# Altium schematic sheet Sheet11.SchDoc
size A3
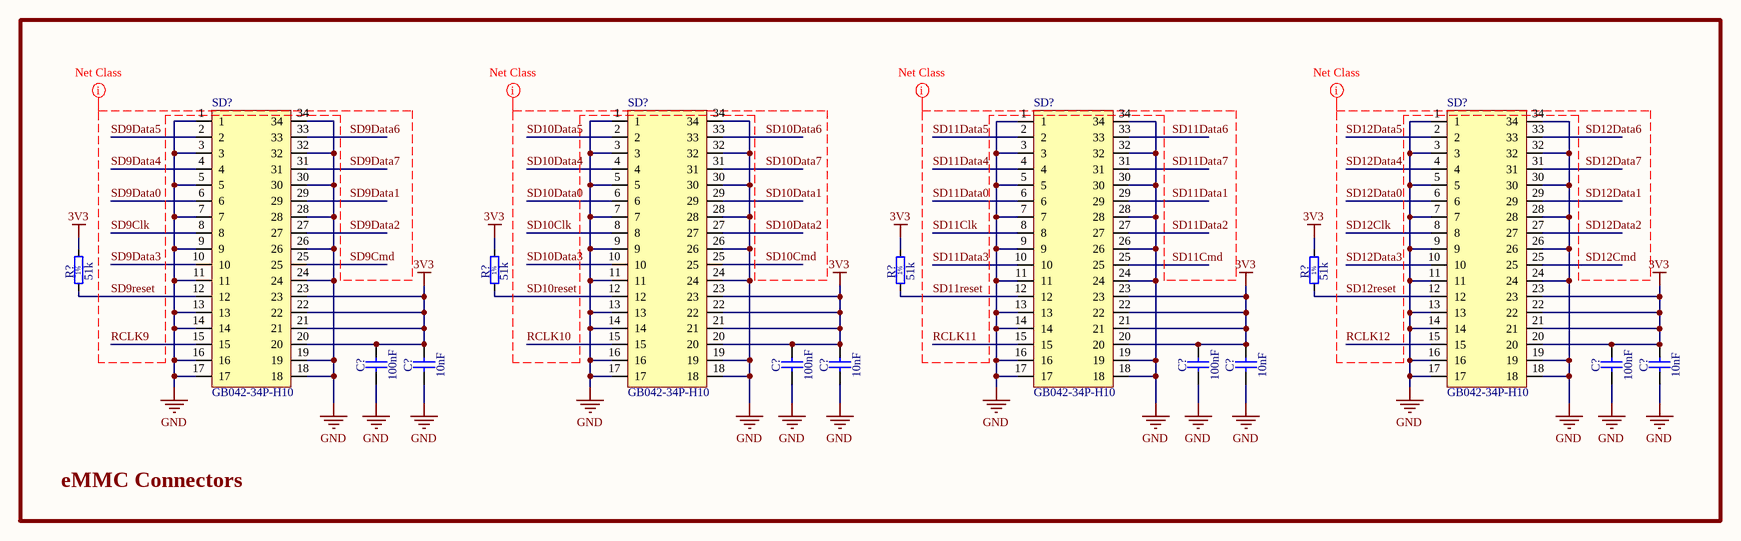
[diagram p0: Sheet11.SchDoc]

## Parts
(Parts that share a designator on the sheet are numbered #1, #2 ... from top to bottom, then left to right.)
C?#1  100nF  [CAPC1608X87N]
C?#2  10nF  [CAPC1608X87N]
C?#3  100nF  [CAPC1608X87N]
C?#4  10nF  [CAPC1608X87N]
C?#5  100nF  [CAPC1608X87N]
C?#6  10nF  [CAPC1608X87N]
C?#7  100nF  [CAPC1608X87N]
C?#8  10nF  [CAPC1608X87N]
R?#1  51k  [RESC1608X55N]
R?#2  51k  [RESC1608X55N]
R?#3  51k  [RESC1608X55N]
R?#4  51k  [RESC1608X55N]
SD?#1  GB042-34P-H10  [GB042-34P-H10]
SD?#2  GB042-34P-H10  [GB042-34P-H10]
SD?#3  GB042-34P-H10  [GB042-34P-H10]
SD?#4  GB042-34P-H10  [GB042-34P-H10]

## Blocks framed on the sheet
eMMC Connectors: C?#1-C?#8 R?#1-R?#4 SD?#1-SD?#4

## Nets
3V3: C?#1.2 C?#2.2 C?#3.2 C?#4.2 C?#5.2 C?#6.2 C?#7.2 C?#8.2 R?#1.2 R?#2.2 R?#3.2 R?#4.2 SD?#1.20 SD?#1.21 SD?#1.22 SD?#1.23 SD?#2.20 SD?#2.21 SD?#2.22 SD?#2.23 SD?#3.20 SD?#3.21 SD?#3.22 SD?#3.23 SD?#4.20 SD?#4.21 SD?#4.22 SD?#4.23
GND: C?#1.1 C?#2.1 C?#3.1 C?#4.1 C?#5.1 C?#6.1 C?#7.1 C?#8.1 SD?#1.1 SD?#1.3 SD?#1.5 SD?#1.7 SD?#1.9 SD?#1.11 SD?#1.13 SD?#1.14 SD?#1.16 SD?#1.17 SD?#1.18 SD?#1.19 SD?#1.24 SD?#1.26 SD?#1.28 SD?#1.30 SD?#1.32 SD?#1.34 SD?#2.1 SD?#2.3 SD?#2.5 SD?#2.7 SD?#2.9 SD?#2.11 SD?#2.13 SD?#2.14 SD?#2.16 SD?#2.17 SD?#2.18 SD?#2.19 SD?#2.24 SD?#2.26 SD?#2.28 SD?#2.30 SD?#2.32 SD?#2.34 SD?#3.1 SD?#3.3 SD?#3.5 SD?#3.7 SD?#3.9 SD?#3.11 SD?#3.13 SD?#3.14 SD?#3.16 SD?#3.17 SD?#3.18 SD?#3.19 SD?#3.24 SD?#3.26 SD?#3.28 SD?#3.30 SD?#3.32 SD?#3.34 SD?#4.1 SD?#4.3 SD?#4.5 SD?#4.7 SD?#4.9 SD?#4.11 SD?#4.13 SD?#4.14 SD?#4.16 SD?#4.17 SD?#4.18 SD?#4.19 SD?#4.24 SD?#4.26 SD?#4.28 SD?#4.30 SD?#4.32 SD?#4.34
RCLK9: SD?#1.15
RCLK10: SD?#2.15
RCLK11: SD?#3.15
RCLK12: SD?#4.15
SD9Clk: SD?#1.8
SD9Cmd: SD?#1.25
SD9Data0: SD?#1.6
SD9Data1: SD?#1.29
SD9Data2: SD?#1.27
SD9Data3: SD?#1.10
SD9Data4: SD?#1.4
SD9Data5: SD?#1.2
SD9Data6: SD?#1.33
SD9Data7: SD?#1.31
SD9reset: R?#1.1 SD?#1.12
SD10Clk: SD?#2.8
SD10Cmd: SD?#2.25
SD10Data0: SD?#2.6
SD10Data1: SD?#2.29
SD10Data2: SD?#2.27
SD10Data3: SD?#2.10
SD10Data4: SD?#2.4
SD10Data5: SD?#2.2
SD10Data6: SD?#2.33
SD10Data7: SD?#2.31
SD10reset: R?#2.1 SD?#2.12
SD11Clk: SD?#3.8
SD11Cmd: SD?#3.25
SD11Data0: SD?#3.6
SD11Data1: SD?#3.29
SD11Data2: SD?#3.27
SD11Data3: SD?#3.10
SD11Data4: SD?#3.4
SD11Data5: SD?#3.2
SD11Data6: SD?#3.33
SD11Data7: SD?#3.31
SD11reset: R?#3.1 SD?#3.12
SD12Clk: SD?#4.8
SD12Cmd: SD?#4.25
SD12Data0: SD?#4.6
SD12Data1: SD?#4.29
SD12Data2: SD?#4.27
SD12Data3: SD?#4.10
SD12Data4: SD?#4.4
SD12Data5: SD?#4.2
SD12Data6: SD?#4.33
SD12Data7: SD?#4.31
SD12reset: R?#4.1 SD?#4.12

## Layout directives
net class SD9: RCLK9, SD9Clk, SD9Cmd, SD9Data0, SD9Data1, SD9Data2, SD9Data3, SD9Data4, SD9Data5, SD9Data6, SD9Data7, SD9reset
net class SD10: RCLK10, SD10Clk, SD10Cmd, SD10Data0, SD10Data1, SD10Data2, SD10Data3, SD10Data4, SD10Data5, SD10Data6, SD10Data7, SD10reset
net class SD11: RCLK11, SD11Clk, SD11Cmd, SD11Data0, SD11Data1, SD11Data2, SD11Data3, SD11Data4, SD11Data5, SD11Data6, SD11Data7, SD11reset
net class SD12: RCLK12, SD12Clk, SD12Cmd, SD12Data0, SD12Data1, SD12Data2, SD12Data3, SD12Data4, SD12Data5, SD12Data6, SD12Data7, SD12reset

## Notes on the sheet
- (in symbol R0603_51K_1%_0.1W_100PPM) 1%

## Library data of the parts
C?#1 C?#3 C?#5 C?#7 = CC0603_100NF_50V_10%_X7R: Non-polarised capacitor; Part Description: SMD Multilayer Chip Ceramic Capacitor; Manufacturer: MULTICOMP; Manufacturer Part Number: MCB0603R104KCT; Manufacturer1 Part Number: 223858615649; Voltage: 50V; TC: X7R; Tolerance: ±10%; Table: Capacitors SMD; Voltage Rating: 16; Capacitance: 0.1; SVHC: No SVHC (17-Dec-2015); Ceramic Capacitor Case: 0603 [1608 Metric]; Dielectric Characteristic: X7; Product Range: MCB Series; Capacitance Tolerance: ± 10%; Capacitor Terminals: SMD; Part Number: CC0603_100NF_50V_10%_X7R; Component Kind: Standard; Component Type: Standard; Pin Count: 2; Value: 100nF; Status: Preferred; Case: 0603; Mounted: Yes; Socket: No; SMD: Yes; Manufacturer1 Example: PHYCOMP; Manufacturer1 ComponentHeight: 0.87mm; HelpURL: \\cern.ch\dfs\Applications\Altium\Datasheets\CC0603_X7R_PHYCOMP.pdf; Author: CERN DEM JLC; CreateDate: 3.12.2007; LatestRevisionDate: 3.12.2007; RoHS: YES; Packaging: Cut Tape; Operating Temperature Min: -55; MSL: -; Supplier Part Number: 9406140; Operating Temperature Range: -55°C to +125°C<!--FANDB--><div class="features-and-benefits-container"><div class="features-and-benefits-description"><span class="features-benefits-value">The MCB0603R104KCT is a multilayer Ceramic Capacitor with 0603 chip, for general digital circuit. Consists of a conducting material and electrodes. To manufacture a chip-type SMT and achieve miniaturization, high density and high efficiency, ceramic condensers are used. MLCC is made by X7; Supplier: Farnell; Capacitance Tolerance ±: ± 10%; Operating Temperature Max: 125
C?#2 C?#4 C?#6 C?#8 = CC0603_10NF_50V_10%_X7R: Non-polarised capacitor; Part Description: SMD Multilayer Chip Ceramic Capacitor; Manufacturer: MULTICOMP; Manufacturer Part Number: MC0603B103K500CT; Manufacturer1 Part Number: 223858615636; Voltage: 50V; TC: X7R; Tolerance: ±10%; Table: Capacitors SMD; Voltage Rating: 50; Product Range: MC Series; No. of Pins: 2; Capacitor Terminals: SMD; Ceramic Capacitor Case: 0603 [1608 Metric]; SVHC: No SVHC (17-Dec-2015); Capacitance Tolerance ±: ± 10%; External Length / Height: 0.8; Dielectric Characteristic: X7; External Depth: 1.6; Capacitance: 0.01; Part Number: CC0603_10NF_50V_10%_X7R; Component Kind: Standard; Component Type: Standard; Pin Count: 2; Value: 10nF; Status: Preferred; Case: 0603; Mounted: Yes; Socket: No; SMD: Yes; Manufacturer1 Example: PHYCOMP; Manufacturer1 ComponentHeight: 0.87mm; HelpURL: \\cern.ch\dfs\Applications\Altium\Datasheets\CC0603_X7R_PHYCOMP.pdf; Author: CERN DEM JLC; CreateDate: 3.12.2007; LatestRevisionDate: 3.12.2007; Operating Temperature Range: -55°C to +125°C<!--FANDB--><div class="features-and-benefits-container"><div class="features-and-benefits-description"><span class="features-benefits-value">The Multicomp MC series is general purpose MLCC capacitors with X7R dielectric material which provides high electrical precision, stability and reliability. This MLCC capacitor consists of a conducting material and electrodes with high density and high efficiency ceramic condensers.</span></div><div class="features-and-benefits-list"><ul class="features-and-benefits-list-list"><li class="features-and-benefits-list-item">Small size with higher capacitance values</li><li class="features-and-benefits-list-item">0201, 0402, 0603, 0805, 1206, 1210, 1812 case sizes available</li><li class="features-and-benefits-list-item">Capacitance value ranging from 100pF to 47?F</li><li class="features-and-benefits-list-item">Capacitor with lead free termination (pure Tin)</li><li class="features-and-benefits-list-item">High electrical precision, stability and reliability</li><li class="features-and-benefits-list-item">Rated voltage of 6.3V, 10V, 16V, 25V, 50V, 100V</li><li class="features-and-benefits-list-item">Operating temperature of -55°C to +125°C</li><li class="features-and-benefits-list-item">Available in ±5%, ±10% and ±20; MSL: -; Supplier: Farnell; Capacitance Tolerance: ± 10%; External Width: 0.8; Supplier Part Number: 1759102; Packaging: Cut Tape; Operating Temperature Max: 125; Operating Temperature Min: -55; RoHS: YES
R?#1-R?#4 = R0603_51K_1%_0.1W_100PPM: Resistor - 1%; Part Description: General Purpose Thick Film Chip Resistor; Manufacturer: Yageo; Manufacturer Part Number: RC0603JR-0751KL; Manufacturer1 Part Number: NRC06F5102TRF; Power: 0.1W; TC: ±100ppm/°C; Tolerance: ±5%; Table: Resistors SMD; Power (Watts): 0.1W, 1/10W; Part Number: R0603_51K_1%_0.1W_100PPM; Component Kind: Standard; Component Type: Standard; Pin Count: 2; Value: 51k; Status: Preferred; Case: 0603; Mounted: Yes; Socket: No; SMD: Yes; Manufacturer1 Example: NIC COMPONENT; Manufacturer1 ComponentHeight: 0.55mm; HelpURL: \\cern.ch\dfs\Applications\Altium\Datasheets\R0603_NIC_NRC.pdf; Author: CERN DEM JLC; CreateDate: 3.12.2007; LatestRevisionDate: 13.03.2008; Height: 0.022" (0.55mm); Features: Moisture Resistant; RoHS: RoHS Compliant; Number of Terminations: 2; Category: Resistors; Composition: Thick Film; Resistance (Ohms): 51k; Size / Dimension: 0.063" L x 0.031" W (1.60mm x 0.80mm); Supplier Part Number: 311-51KGRCT-ND; Supplier Device Package: 0603; Package / Case: 0603 (1608 Metric); Supplier: Digi-Key; Temperature Coefficient: ±100ppm/°C; Packaging: Cut Tape (CT); Operating Temperature: -55°C ~ 155°C
SD?#1-SD?#4 = GB042-34P-H10: Connector, eMMC